# EAGLE design 32U4_Breakout (EAGLE 6.4)
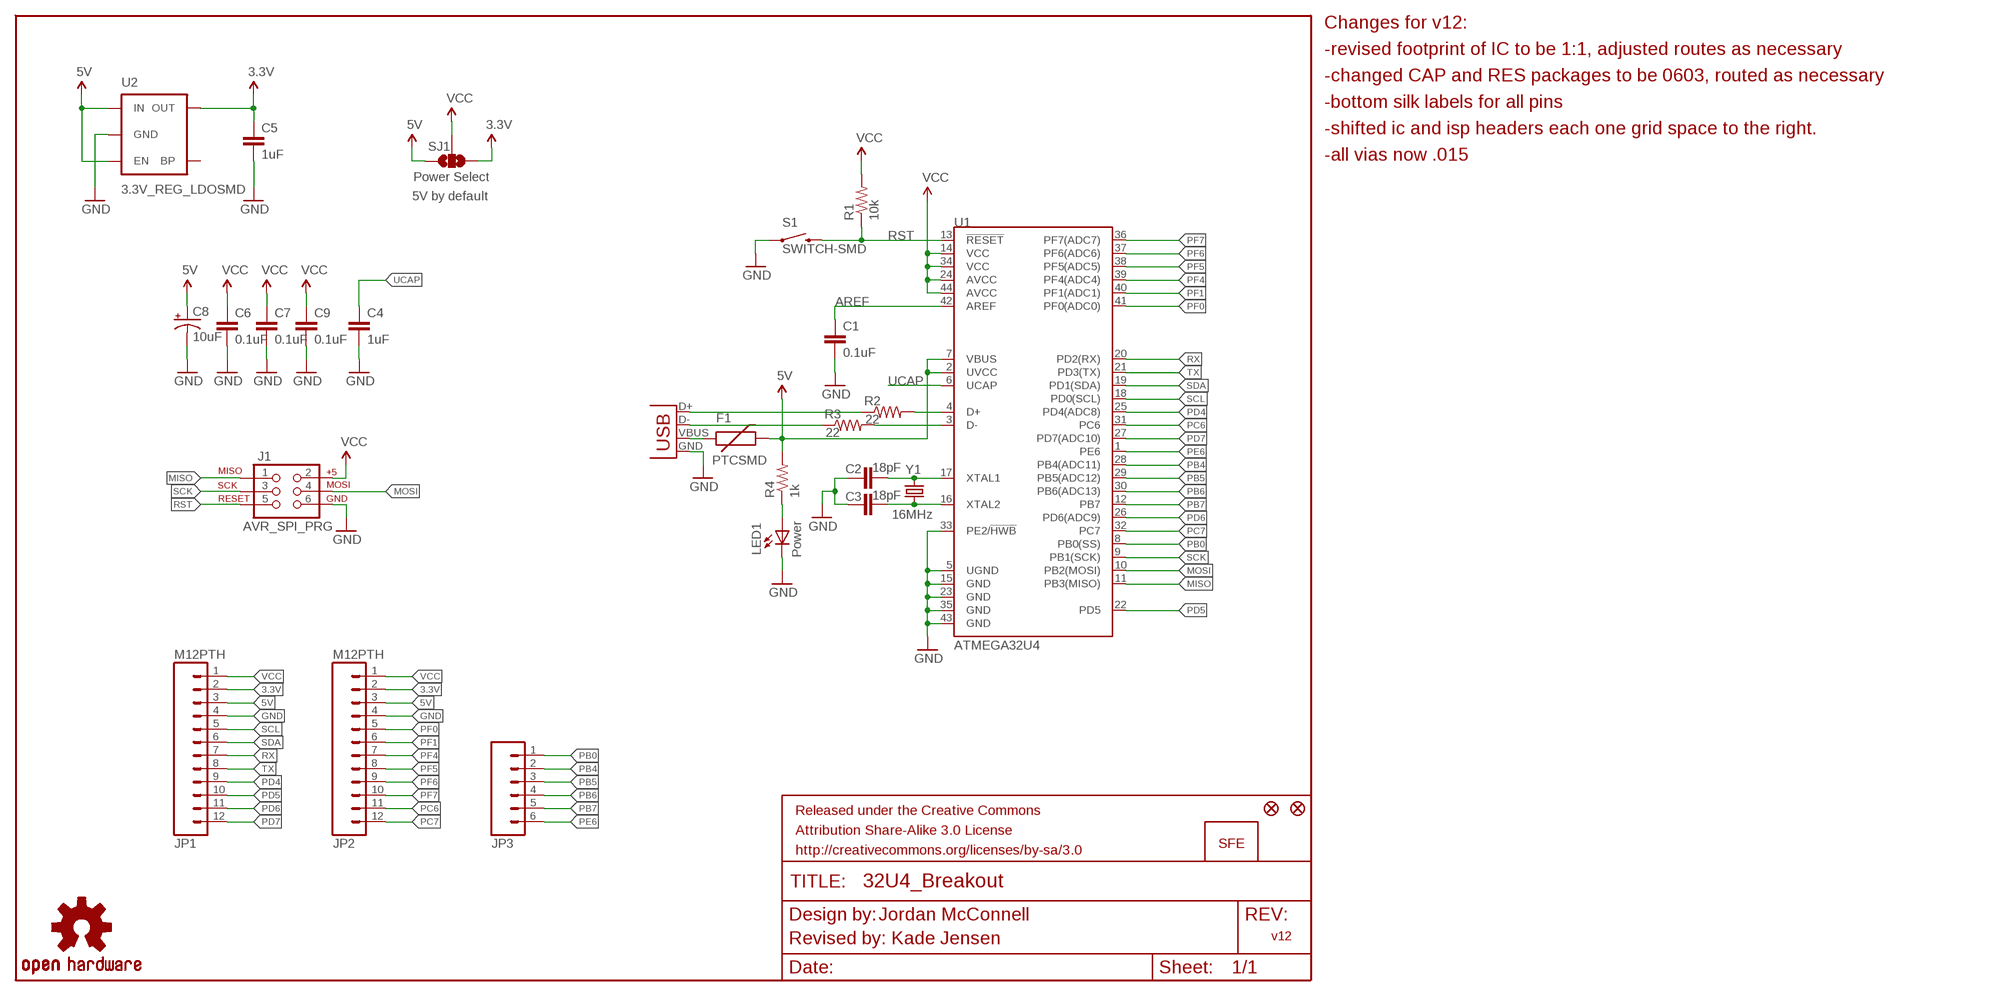
[diagram p0: schematic, sheet 1]

## Parts
C1  0.1uF  CAP0603-CAP  [0603-CAP]
C2  18pF  CAP0603-CAP  [0603-CAP]
C3  18pF  CAP0603-CAP  [0603-CAP]
C4  1uF  CAP0603-CAP  [0603-CAP]
C5  1uF  CAP0603-CAP  [0603-CAP]
C6  0.1uF  CAP0603-CAP  [0603-CAP]
C7  0.1uF  CAP0603-CAP  [0603-CAP]
C8  10uF  CAP_POL1206  [EIA3216]
C9  0.1uF  CAP0603-CAP  [0603-CAP]
F1  PTCSMD  [PTC-1206]
J1  AVR_SPI_PRG  AVR_SPI_PRG_6PTH  [2X3]
JP1  M12PTH  [1X12]
JP2  M12PTH  [1X12]
JP3  M06SIP  [1X06]
JP6  FIDUCIAL1X2  [FIDUCIAL-1X2]
JP7  FIDUCIAL1X2  [FIDUCIAL-1X2]
JP8  LOGO-SFENEW  [SFE-NEW-WEBLOGO]
LED1  Power  LED0603  [LED-0603]
R1  10k  RESISTOR0603-RES  [0603-RES]
R2  22  RESISTOR0603-RES  [0603-RES]
R3  22  RESISTOR0603-RES  [0603-RES]
R4  1k  RESISTOR0603-RES  [0603-RES]
S1  SWITCH-SMD  SWITCH-MOMENTARY-2SMD  [TACTILE_SWITCH_SMD]
SJ1  Power Select  SOLDERJUMPER_2WAYPASTE2&3  [SJ_3_PASTE2&3]
U1  ATMEGA32U4  ATMEGA32U41:1  [QFN-44-NOPAD_1:1]
U2  3.3V_REG_LDOSMD  V_REG_LDOSMD  [SOT23-5]
U$6  OSHW-LOGOM  [OSHW-LOGO-M]
X1  USBSMD  [USB-MINIB]
Y1  16MHz  CRYSTAL5X3  [CRYSTAL-SMD-5X3]

## Nets
3.3V: C5.1 JP1.2 JP2.2 SJ1.1 U2.5(OUT)
5V: C8.A(+) F1.2 JP1.3 JP2.3 R4.2 SJ1.3 U1.2(UVCC) U1.7(VBUS) U2.1(IN) U2.3(EN)
AREF: C1.1 U1.42(AREF)
D+: R2.1 X1.D+
D-: R3.1 X1.D-
GND: C1.2 C2.1 C3.1 C4.2 C5.2 C6.2 C7.2 C8.C(-) C9.2 J1.6 JP1.4 JP2.4 LED1.C S1.1 U1.5(UGND) U1.15(GND) U1.23(GND) U1.33(PE2/!HWB) U1.35(GND) U1.43(GND) U2.2(GND) X1.GND
MISO: J1.1 U1.11(PB3(MISO))
MOSI: J1.4 U1.10(PB2(MOSI))
N$2: C2.2 U1.17(XTAL1) Y1.3
N$3: C3.2 U1.16(XTAL2) Y1.1
N$4: F1.1 X1.VBUS
N$6: R2.2 U1.4(D+)
N$8: R3.2 U1.3(D-)
N$9: LED1.A R4.1
PB0: JP3.1 U1.8(PB0(SS))
PB4: JP3.2 U1.28(PB4(ADC11))
PB5: JP3.3 U1.29(PB5(ADC12))
PB6: JP3.4 U1.30(PB6(ADC13))
PB7: JP3.5 U1.12(PB7)
PC6: JP2.11 U1.31(PC6)
PC7: JP2.12 U1.32(PC7)
PD4: JP1.9 U1.25(PD4(ADC8))
PD5: JP1.10 U1.22(PD5)
PD6: JP1.11 U1.26(PD6(ADC9))
PD7: JP1.12 U1.27(PD7(ADC10))
PE6: JP3.6 U1.1(PE6)
PF0: JP2.5 U1.41(PF0(ADC0))
PF1: JP2.6 U1.40(PF1(ADC1))
PF4: JP2.7 U1.39(PF4(ADC4))
PF5: JP2.8 U1.38(PF5(ADC5))
PF6: JP2.9 U1.37(PF6(ADC6))
PF7: JP2.10 U1.36(PF7(ADC7))
RST: J1.5 R1.1 S1.3 U1.13(!RESET)
RX: JP1.7 U1.20(PD2(RX))
SCK: J1.3 U1.9(PB1(SCK))
SCL: JP1.5 U1.18(PD0(SCL))
SDA: JP1.6 U1.19(PD1(SDA))
TX: JP1.8 U1.21(PD3(TX))
UCAP: C4.1 U1.6(UCAP)
VCC: C6.1 C7.1 C9.1 J1.2 JP1.1 JP2.1 R1.2 SJ1.2 U1.14(VCC) U1.24(AVCC) U1.34(VCC) U1.44(AVCC)
Unconnected: U2.4(BP)

## Notes on the sheet
- Changes for v12:
- -revised footprint of IC to be 1:1, adjusted routes as necessary
- -changed CAP and RES packages to be 0603, routed as necessary
- -bottom silk labels for all pins
- -shifted ic and isp headers each one grid space to the right.
- -all vias now .015
- 5V by default
- Jordan McConnell
- v12
- Revised by: Kade Jensen

## Library data of the parts
C1-C7 C9 = SparkFun-Capacitors:CAP: Capacitor Standard 0603 ceramic capacitor, and 0.1" leaded capacitor.
C8 = SparkFun:CAP_POL: Capacitor Polarized These are standard SMD and PTH capacitors. Normally 10uF, 47uF, and 100uF in electrolytic and tantalum varieties. Always verify the external diameter of the through hole cap, it varies with capacity, voltage, and manufacturer. The EIA devices should be standard.
F1 = SparkFun:PTC: Resettable Fuse PTC Resettable Fuse. Spark Fun Electronics SKU : COM-08357
J1 = SparkFun:AVR_SPI_PRG_6: AVR ISP 6 Pin This is the reduced ISP connector for AVR programming. Common on Arduino. This footprint will take up less PCB space and can be used with a 10-pin to 6-pin adapter such as SKU: BOB-08508
JP1 JP2 = SparkFun:M12: Header 12 Standard 12-pin 0.1" header. Use with straight break away headers (SKU : PRT-00116), right angle break away headers (PRT-00553), swiss pins (PRT-00743), machine pins (PRT-00117), and female headers (PRT-00115).
JP3 = SparkFun:M06: Header 6 Standard 6-pin 0.1" header. Use with straight break away headers (SKU : PRT-00116), right angle break away headers (PRT-00553), swiss pins (PRT-00743), machine pins (PRT-00117), and female headers (PRT-00115). Molex polarized connector foot print use with SKU : PRT-08094 with associated crimp pins and housings. NOTES ON THE VARIANTS LOCK and LOCK_LONGPADS... This footprint was designed to help hold the alignment of a through-hole component (i.e. 6-pin header) while soldering it into place. You may notice that each hole has been shifted either up or down by 0.005 of an inch from it's more standard position (which is a perfectly straight line). This slight alteration caused the pins (the squares in the middle) to touch the edges of the holes. Because they are alternating, it causes a "brace" to hold the component in place. 0.005 has proven to be the perfect amount of "off-center" position when using our standard breakaway headers. Although looks a little odd when you look at the bare footprint, once you have a header in there, the alteration is very hard to notice. Also, if you push a header all the way into place, it is covered up entirely on the bottom side. This idea of altering the position of holes to aid alignment will be further integrated into the Sparkfun Library for other footprints. It can help hold any component with 3 or more connection pins.
JP6 JP7 = SparkFun:FIDUCIAL: Fiducial Alignment Points Various fiducial points for machine vision alignment.
JP8 = SparkFun-Aesthetics:LOGO-SFE: Spark Fun Electronics PCB Logo This is the standard Spark Fun Electronics PCB logo.
LED1 = SparkFun:LED: LEDs Standard schematic elements and footprints for 5mm, 3mm, 1206, and 0603 sized LEDs. 5mm - Spark Fun Electronics SKU : COM-00529 (and others)
R1-R4 = SparkFun-Resistors:RESISTOR: Resistor Basic schematic elements and footprints for 0603, 1206, and PTH resistors.
S1 = SparkFun:SWITCH-MOMENTARY-2
SJ1 = SparkFun:SOLDERJUMPER_2WAY: Solder Jumper 2 way solder jumper
U1 = Testing:ATMEGA32U4: Atmel 44-pin 8-bit Microcontroller with 32KBytes of ISP Flash and USB Controller
U2 = SparkFun:V_REG_LDO: Voltage Regulator LDO Standard 150mA LDO voltage regulator in SOT-23 layout. Micrel part MIC5205. BP (by-pass) pin is used to lower output noise with 470pF cap.
U$6 = SparkFun:OSHW-LOGO: Open Source Hardware Logo This logo indicates the piece of hardware it is found on incorporates a OSHW license and/or adheres to the definition of open source hardware found here: http://freedomdefined.org/OSHW
X1 = SparkFun:USB: USB Connectors USB-B-PTH is fully proven SKU : PRT-00139 USB-miniB is fully proven SKU : PRT-00587 USB-A-PCB is untested. USB-A-H is throughly reviewed, but untested. Spark Fun Electronics SKU : PRT-00437 USB-B-SMT is throughly reviewed, but untested. Needs silkscreen touching up. USB-A-S has not been used/tested USB-MB-H has not been used/tested
Y1 = SparkFun:CRYSTAL: Crystals Various standard crystals. Proven footprints. Spark Fun Electronics SKU : COM-00534

## Board
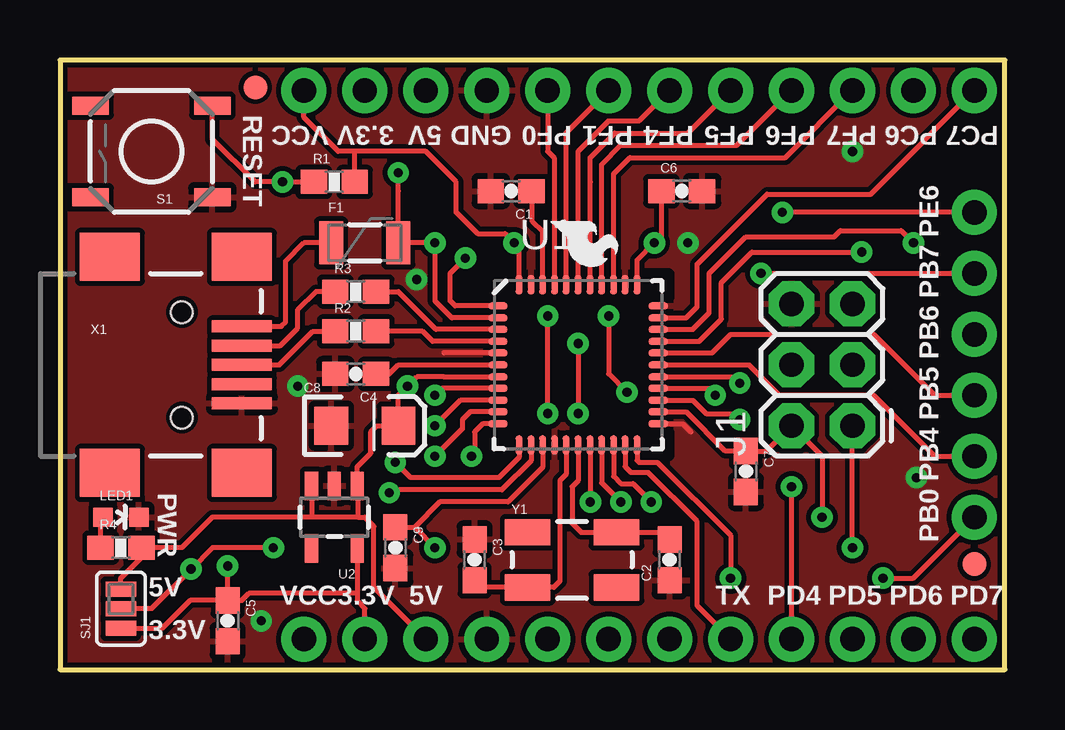
[diagram p1: board, top side]
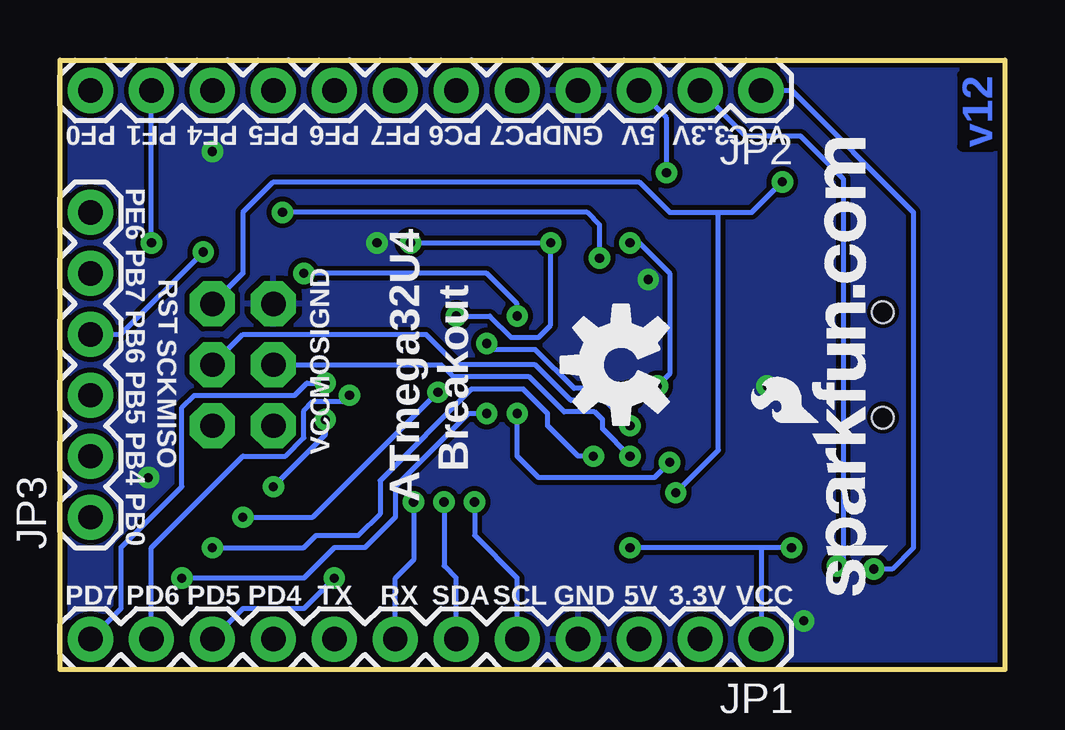
[diagram p2: board, bottom side, seen from below]

Size 39.37 x 25.4 mm. Coordinates in mm from the lower left corner, seen from the top.
Outline: 0,0 39.37,0 39.37,25.4 0,25.4 0,0
Copper layers (1*16): Top 0.035mm / dielectric 1.5mm / Bottom 0.035mm
Design rules "SparkFun": minimum track width 7mil, minimum drill 15mil, track to track 8mil, track to pad 8mil, pad to pad 8mil, via to via 8mil, smd to smd 8mil, copper to edge 8mil, drill to drill 8mil, minimum pad ring 12mil, minimum via ring 10mil, stop-mask expansion 4mil, vias tented up to drill 20mil, thermal gap 10mil
tRestrict: area 24.4,15.5 to 25.4,16.5; area 19.4,15.4 to 19.8,15.5; area 23.4,15.4 to 23.7,15.5; area 24.3,15 to 24.4,15.4; area 18.7,13 to 18.8,13.5; area 24.4,8.9 to 25.4,9.9; area 17.8,8.9 to 18.8,9.9; area 17.8,15.5 to 18.8,16.5; area 24.3,10.2 to 24.4,10.4

### Footprints (pad centres in the part's own frame; a part is rotated, then mirrored left to right if it is on the bottom)
0603-CAP = smd 1.1 x 1: 1 -0.85,0; 2 0.85,0
EIA3216 = smd 1.4 x 1.6: A 1.4,0; C -1.4,0
PTC-1206 = smd 1 x 1.8: 1 -1.4,0; 2 1.4,0
2X3 = drill 1.016 pad 1.88 octagon: 1 0,0; 2 0,2.54; 3 2.54,0; 4 2.54,2.54; 5 5.08,0; 6 5.08,2.54
1X12 = drill 1.016 pad 1.88: 1 0,0; 2 2.54,0; 3 5.08,0; 4 7.62,0; 5 10.16,0; 6 12.7,0; 7 15.24,0; 8 17.78,0; 9 20.32,0; 10 22.86,0; 11 25.4,0; 12 27.94,0
1X06 = drill 1.016 pad 1.88: 1 0,0; 2 2.54,0; 3 5.08,0; 4 7.62,0; 5 10.16,0; 6 12.7,0
FIDUCIAL-1X2 = smd 1 x 1: 1 0,0
LED-0603 = smd 0.8 x 0.8: A 0,-0.75; C 0,0.75
0603-RES = smd 1.1 x 1: 1 -0.85,0; 2 0.85,0
TACTILE_SWITCH_SMD = smd 1.524 x 0.762: 1 -2.54,1.905; 2 2.54,1.905; 3 -2.54,-1.905; 4 2.54,-1.905
SJ_3_PASTE2&3 = smd 0.635 x 1.27: 1 -0.813,0; 2 0,0; 3 0.813,0
QFN-44-NOPAD_1:1 = smd 0.8 x 0.3: 1 -3.337,2.458; 2 -3.337,1.958; 3 -3.337,1.479; 4 -3.337,0.979; 5 -3.337,0.5; 6 -3.337,0; 7 -3.337,-0.5; 8 -3.337,-0.979; 9 -3.337,-1.479; 10 -3.337,-1.958; 11 -3.337,-2.458; 23 3.337,-2.458; 24 3.337,-1.958; 25 3.337,-1.479; 26 3.337,-0.979; 27 3.337,-0.5; 28 3.337,0; 29 3.337,0.5; 30 3.337,0.979; 31 3.337,1.479; 32 3.337,1.958; 33 3.337,2.458 | smd 0.3 x 0.8: 12 -2.458,-3.337; 13 -1.958,-3.337; 14 -1.479,-3.337; 15 -0.979,-3.337; 16 -0.5,-3.337; 17 0,-3.337; 18 0.5,-3.337; 19 0.979,-3.337; 20 1.479,-3.337; 21 1.958,-3.337; 22 2.458,-3.337; 34 2.458,3.337; 35 1.958,3.337; 36 1.479,3.337; 37 0.979,3.337; 38 0.5,3.337; 39 0,3.337; 40 -0.5,3.337; 41 -0.979,3.337; 42 -1.479,3.337; 43 -1.958,3.337; 44 -2.458,3.337
SOT23-5 = smd 0.55 x 1.2: 1 -0.95,-1.3; 2 0,-1.3; 3 0.95,-1.3; 4 0.95,1.3; 5 -0.95,1.3
USB-MINIB = smd 2.5 x 0.5: D+ 2.5,0; D- 2.5,0.8; GND 2.5,-1.6; ID 2.5,-0.8; VBUS 2.5,1.6 | smd 2.5 x 2: MTN1 -3,4.5; MTN2 2.5,4.5; MTN3 -3,-4.5; MTN4 2.5,-4.5 | hole 0.9: 0,2.2; 0,-2.2
CRYSTAL-SMD-5X3 = smd 1.9 x 1.1: 1 -1.85,-1.15; 2 1.85,-1.15; 3 1.85,1.15; 4 -1.85,1.15

### Placement (x,y rotation side)
C1  18.8,19.94 180 top
C2  25.4,4.57 90 top
C3  17.27,4.57 270 top
C4  12.32,12.32 180 top
C5  6.99,2.03 270 top
C6  25.91,19.94 0 top
C7  28.57,8.26 270 top
C8  12.7,10.16 0 top
C9  13.97,5.08 270 top
F1  12.7,17.78 0 top
J1  33.02,10.16 90 top
JP1  10.16,1.27 180 bottom
JP2  10.16,24.13 180 bottom
JP3  38.1,6.35 90 bottom
JP5  LOGO-SFESK  [SFE-LOGO-FLAME]  20.45,18.67 270 top
JP6  8.14,24.26 0 top
JP7  38.1,4.39 0 top
JP8  4.89,3.1 90 bottom
LED1  2.54,6.35 270 top
R1  11.43,20.32 0 top
R2  12.32,14.1 0 top
R3  12.32,15.75 0 top
R4  2.54,5.08 0 top
S1  3.81,21.59 180 top
SJ1  2.54,2.54 90 top
U1  21.59,12.7 0 top
U2  11.43,6.35 180 top
U$6  16,12.7 90 bottom
X1  5.08,12.7 0 top
Y1  21.34,4.57 0 top

### Tracks (layer width: path | path; a pad name or v marks a point on that pad's centre or on a via)
3.3V  (via drill 0.38)
  Top 0.203: SJ1.1 4.27,1.73 5.42,2.88 C5.1 | JP1.2 12.7,2.54 12.38,2.86 12.38,3.17 | U2.5 12.38,3.17 | 12.38,3.17 7.87,3.17 7.58,2.88 C5.1 | C5.1 v6.99,4.32
  Bottom 0.203: JP2.2 10.79,22.23 8.51,22.23 6.73,20.45 6.73,4.57 v6.99,4.32
5V  (via drill 0.38)
  Top 0.203: 2.59,3.3 SJ1.3 2.54,3.81 3.39,4.66 R4.2 5.08,5.08 6.35,6.35 10.48,6.35 | v14.1,20.7 14.1,19.94 F1.2 v15.62,17.78 15.62,15.37 16.33,14.66 U1.2 | U1.7 16.01,12.2 14.87,12.2 v14.48,11.81 14.1,11.43 C8.A 13.21,10.16 12.95,9.91 12.95,9.02 12.38,8.44 U2.1 12.41,7.62 12.41,6.35 | JP1.3 13.08,3.43 13.08,5.97 12.7,6.35 12.41,6.35 | 12.41,6.35 10.48,6.35 | U2.3 10.48,6.35
  Bottom 0.203: v14.1,20.7 14.1,22.99 JP2.3 | v15.62,17.78 15.24,17.78 13.97,16.51 13.97,12.32 v14.48,11.81
AREF
  Top 0.203: U1.42 20.11,18.24 19.68,18.67 19.68,19.9 C1.1
D+
  Top 0.203: R2.1 10.54,14.1 9.14,12.7 X1.D+
D-
  Top 0.203: R3.1 10.67,15.75 9.91,14.99 9.91,14.22 9.18,13.5 X1.D-
GND  (via drill 0.38, 0.38 pad 0.38)
  Top 0.203: U1.5 16.01,13.2 16,13.21 | U1.23 25.95,10.24 26.29,9.91
  other vias: 9.91,11.81 8.38,2.03 14.86,16.26 26.16,17.78 33.02,21.59 35.69,8
  pour Top (isolate 0.203): 39.37,25.4 0,25.4 0,0 39.37,0
  pour Bottom (isolate 0.203): 39.37,25.4 39.37,0 0,0 0,25.4
MISO  (via drill 0.38)
  Top 0.203: U1.11 17.61,10.24 17.27,9.91 17.27,9.02 v17.14,8.89 | v33.02,5.08 J1.1
  Bottom 0.203: v17.14,8.89 17.78,8.89 19.05,10.16 19.05,10.67 20.07,11.68 22.23,11.68 26.04,7.87 26.04,6.48 26.92,5.59 28.7,5.59 29.21,5.08 v33.02,5.08
MOSI  (via drill 0.38)
  Top 0.203: U1.10 17.09,10.74 16.76,10.41 16.76,10.03 v15.62,8.89
  Bottom 0.203: v15.62,8.89 16.76,10.03 16.76,10.41 17.09,10.74 18.36,10.74 19.81,12.19 22.99,12.19 23.5,12.7 J1.4
N$2
  Top 0.203: C2.2 25.1,5.72 Y1.3 23.18,5.71 21.72,5.71 21.34,6.1 21.34,7.62 21.59,7.87 U1.17
N$3
  Top 0.203: C3.2 17.57,3.42 Y1.1 20.57,3.43 20.83,3.68 20.83,7.87 21.09,8.14 U1.16
N$4
  Top 0.203: X1.VBUS 9.22,14.3 9.4,14.48 9.4,17.02 10.16,17.78 F1.1
N$6
  Top 0.203: U1.4 15.53,13.68 15.11,14.1 R2.2
N$8
  Top 0.203: U1.3 15.67,14.18 14.1,15.75 R3.2
N$9
  Top 0.203: R4.1 1.69,6.25 LED1.A
PB0  (via drill 0.38)
  Top 0.203: U1.8 15.91,11.72 v15.62,11.43 | v21.59,13.59 v21.59,10.67 | v34.29,3.81 35.56,3.81 JP3.1
  Bottom 0.203: v15.62,11.43 15.91,11.72 17.94,11.72 19.56,13.34 21.34,13.34 v21.59,13.59 | v34.29,3.81 29.21,3.81 27.94,5.08 26.67,5.08 25.4,6.35 25.4,7.62 22.35,10.67 v21.59,10.67
PB4
  Top 0.203: U1.28 28.7,12.7 29.97,11.43 33.91,11.43 36.45,8.89 JP3.2
PB5
  Top 0.203: JP3.3 36.45,11.43 34.1,13.78 33.91,13.97 27.94,13.97 27.17,13.2 U1.29
PB6  (via drill 0.38)
  Top 0.203: U1.30 26.63,13.68 27.56,14.61 27.56,16.13 28.83,17.4 v33.4,17.4
  Bottom 0.203: JP3.4 36.83,13.97 v33.4,17.4
PB7  (via drill 0.38)
  Top 0.203: U1.12 19.13,8.85 18.29,8 14.61,8 v13.97,8.64 | v20.32,10.67 v20.32,14.73 | v29.21,16.51 JP3.5
  Bottom 0.203: v13.97,8.64 14.61,8 19.43,8 20.32,8.89 v20.32,10.67 | v20.32,14.73 20.32,15.24 21.59,16.51 v29.21,16.51
PC6  (via drill 0.38 pad 0.38)
  Top 0.203: U1.31 26.37,14.18 27.05,14.86 27.05,16.51 28.57,18.03 32.26,18.03 32.51,18.29 35.05,18.29 v35.56,17.78
  Bottom 0.203: v35.56,17.78 JP2.11
PC7
  Top 0.203: U1.32 26.09,14.66 26.54,15.11 26.54,16.89 29.46,19.81 33.78,19.81 JP2.12
PD4  (via drill 0.38)
  Top 0.203: U1.25 26.37,11.22 26.92,10.67 28.07,10.67 v28.32,10.41 | JP1.9 v30.48,7.62
  Bottom 0.203: v28.32,10.41 28.32,9.78 v30.48,7.62
PD5  (via drill 0.38)
  Top 0.203: U1.22 24.05,8.72 24.13,8.64 24.89,8.64 27.94,5.59 v27.94,3.81
  Bottom 0.203: v27.94,3.81 29.21,2.54 31.75,2.54 JP1.10
PD6  (via drill 0.38)
  Top 0.203: U1.26 27.01,11.72 v27.3,11.43
  Bottom 0.203: JP1.11 35.56,5.08 31.75,8.89 29.97,8.89 29.21,9.65 29.21,10.79 28.83,11.18 27.56,11.18 v27.3,11.43
PD7  (via drill 0.38)
  Top 0.203: U1.27 28.06,12.2 v28.32,11.94
  Bottom 0.203: 28.7,11.94 v28.32,11.94 29.08,11.94 29.59,11.43 33.78,11.43 34.29,10.92 34.29,7.62 36.83,5.08 36.83,2.54 JP1.12
PE6  (via drill 0.38)
  Top 0.203: v16.89,17.14 16.26,16.51 16.26,15.37 16.46,15.16 U1.1 | JP3.6 v30.1,19.05
  Bottom 0.203: v30.1,19.05 17.4,19.05 16.89,18.54 v16.89,17.14
PF0
  Top 0.203: JP2.5 20.32,21.59 20.61,21.3 U1.41
PF1
  Top 0.203: U1.40 21.09,22.36 JP2.6
PF4
  Top 0.203: U1.39 21.59,21.59 22.86,22.86 24.13,22.86 JP2.7
PF5
  Top 0.203: U1.38 22.09,20.31 | 22.09,20.31 22.1,20.32 | JP2.8 26.16,22.35 23.11,22.35 22.09,21.33 22.09,20.31
PF6
  Top 0.203: U1.37 22.57,21.05 23.37,21.84 28.19,21.84 JP2.9
PF7
  Top 0.203: U1.36 23.07,20.66 23.75,21.34 30.23,21.34 JP2.10
RST  (via drill 0.38)
  Top 0.203: R1.1 v9.27,20.32 8.13,20.32 6.35,22.1 S1.3 | U1.13 19.63,8.71 18.41,7.49 13.84,7.49 v13.72,7.37
  Bottom 0.203: J1.5 31.75,16.51 31.75,19.05 30.48,20.32 15.24,20.32 13.97,19.05 11.94,19.05 | v13.72,7.37 11.94,9.14 11.94,19.05 | 11.94,19.05 10.54,19.05 v9.27,20.32
RX  (via drill 0.38)
  Top 0.203: U1.20 23.07,8.05 23.37,7.75 23.88,7.75 v24.64,6.99
  Bottom 0.203: JP1.7 25.4,3.81 24.64,4.57 v24.64,6.99
SCK  (via drill 0.38)
  Top 0.203: U1.9 16.68,11.22 v15.62,10.16
  Bottom 0.203: v15.62,10.16 16.68,11.22 18.08,11.22 19.56,12.7 22.86,12.7 24.13,13.97 31.75,13.97 J1.3
SCL  (via drill 0.38)
  Top 0.203: U1.18 v22.09,6.99 v22.1,6.99
  Bottom 0.203: JP1.5 20.32,3.81 22.1,5.59 v22.1,6.99
SDA  (via drill 0.38)
  Top 0.203: U1.19 22.57,7.78 v23.37,6.99
  Bottom 0.203: JP1.6 22.86,3.81 23.37,4.32 v23.37,6.99
TX
  Top 0.203: U1.21 23.55,8.46 23.79,8.22 24.5,8.22 26.54,6.17 26.54,2.67 JP1.8
UCAP
  Top 0.203: U1.6 14.1,12.7 13.72,12.32 C4.1
VCC  (via drill 0.38)
  Top 0.203: 12.28,21.59 15.24,21.59 16.51,20.32 16.51,19.05 17.4,18.16 18.54,18.16 v18.92,17.78 19.13,17.57 U1.44 | 12.28,21.59 11.59,21.59 10.16,23.02 JP2.1 | R1.2 12.28,21.59 | U1.14 20.11,8.43 18.67,6.99 15.83,6.99 14.77,5.93 | C9.1 14.77,5.93 | 14.77,5.93 v15.62,5.08 | U1.34 24.05,17.06 v24.77,17.78 25.06,18.07 C6.1 | U1.24 26.09,10.74 27.73,9.11 C7.1 29.43,9.11 J1.2 31.75,8.89 v31.75,6.35 | v22.86,14.73 22.86,12.32 v23.62,11.56 | v8.89,5.08 6.35,5.08 v5.46,4.19 3.81,2.54 SJ1.2
  Bottom 0.203: 10.16,5.08 JP1.1 | v8.89,5.08 10.16,5.08 | 10.16,5.08 v15.62,5.08 | v24.77,17.78 v18.92,17.78 18.92,14.35 19.43,13.84 20.57,13.84 21.46,14.73 v22.86,14.73 | v31.75,6.35 28.83,6.35 v23.62,11.56 | JP2.1 8.89,24.13 3.81,19.05 3.81,5.08 4.7,4.19 v5.46,4.19

### Text on the board
Bottom: v12
tPlace: RESET | VCC | 3.3V | 5V | GND | PF0 | PF1 | PF4 | PF5 | PF6 | PF7 | PC6 | PC7 | PE6 | PB7 | PB6 | PB5 | PB4 | PWR | PB0 | 5V | VCC | 3.3V | 5V | TX | PD4 | PD5 | PD6 | PD7 | 3.3V
bPlace: VCC | 3.3V | 5V | GND | PC7 | PC6 | PF7 | PF6 | PF5 | PF4 | PF1 | PF0 | PE6 | PB7 | RST | PB6 | GND | SCK | PB5 | MOSI | MISO | PB4 | VCC | Breakout | ATmega32U4 | PB0 | VCC | 3.3V | 5V | GND | SCL | SDA | RX | TX | PD4 | PD5 | PD6 | PD7
tValues: Jordan McConnell